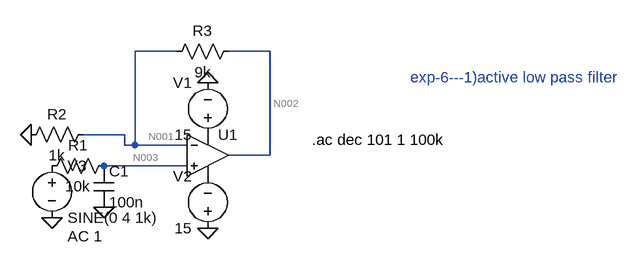
[diagram p0: schematic active low pass filter.asc]
active low pass filter.asc, the LTspice schematic file:
Version 4
SHEET 1 880 680
WIRE 128 16 64 16
WIRE 272 16 208 16
WIRE 48 144 -16 144
WIRE 48 160 48 144
WIRE 64 160 64 16
WIRE 64 160 48 160
WIRE 144 160 64 160
WIRE 272 176 272 16
WIRE 272 176 208 176
WIRE 144 192 16 192
FLAG 176 288 0
FLAG 176 64 0
FLAG -64 272 0
FLAG -96 144 0
FLAG 16 256 0
SYMBOL Opamps\\UniversalOpamp2 176 176 R0
SYMATTR InstName U1
SYMBOL voltage 176 160 R180
WINDOW 0 24 96 Left 2
WINDOW 3 24 16 Left 2
WINDOW 123 0 0 Left 0
WINDOW 39 0 0 Left 0
SYMATTR InstName V1
SYMATTR Value 15
SYMBOL voltage 176 304 R180
WINDOW 0 24 96 Left 2
WINDOW 3 24 16 Left 2
WINDOW 123 0 0 Left 0
WINDOW 39 0 0 Left 0
SYMATTR InstName V2
SYMATTR Value 15
SYMBOL res 32 176 R90
WINDOW 0 0 56 VBottom 2
WINDOW 3 32 56 VTop 2
SYMATTR InstName R1
SYMATTR Value 10k
SYMBOL cap 0 192 R0
SYMATTR InstName C1
SYMATTR Value 100n
SYMBOL voltage -64 176 R0
WINDOW 123 24 124 Left 2
WINDOW 39 0 0 Left 0
SYMATTR Value2 AC 1
SYMATTR InstName V3
SYMATTR Value SINE(0 4 1k)
SYMBOL res 0 128 R90
WINDOW 0 0 56 VBottom 2
WINDOW 3 32 56 VTop 2
SYMATTR InstName R2
SYMATTR Value 1k
SYMBOL res 224 0 R90
WINDOW 0 0 56 VBottom 2
WINDOW 3 32 56 VTop 2
SYMATTR InstName R3
SYMATTR Value 9k
TEXT 488 56 Left 2 ;exp-6---1)active low pass filter
TEXT 336 152 Left 2 !.ac dec 101 1 100k

The netlist it stands for:
* active low pass filter.asc
XU1 N003 N001 P001 P002 N002 level.2 Avol=1Meg GBW=10Meg Slew=10Meg ilimit=25m rail=0 Vos=0 phimargin=45 en=0 enk=0 in=0 ink=0 Rin=500Meg  ; pins IN+ IN- V+ V- OUT
V1 P001 0 15
V2 0 P002 15
R1 N003 P003 10k
C1 N003 0 100n
V3 P003 0 SINE(0 4 1k) AC 1
R2 N001 0 1k
R3 N002 N001 9k
* exp-6---1)active low pass filter
.ac dec 101 1 100k
.lib UniversalOpamps2.sub
.backanno
.end

* Results of the author's LTspice run, read from the files saved beside the schematic
* Operating Point, zero values left out:
*   V(p001) = 15 V
*   V(p002) = -15 V
*   I(V2) = -1.498 mA
*   I(V1) = -1.498 mA
*   Ix(u1:3) = 1.498 mA
*   Ix(u1:4) = -1.498 mA
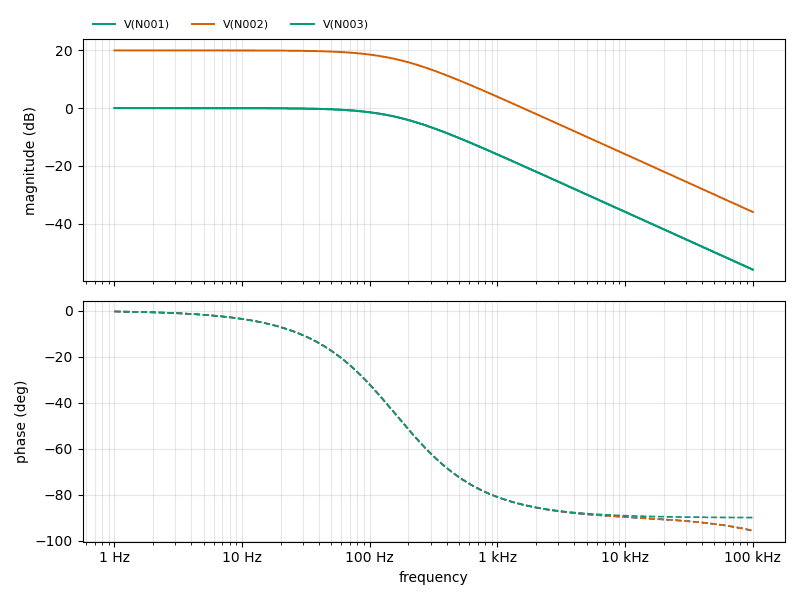
[diagram p1: AC Analysis of active low pass filter.asc, plotted from the saved traces]
* AC Analysis, 1 run:
*   V(N001): -0.00 dB at 1 Hz, -56.01 dB at 100 kHz, peak -0.00 dB at 1 Hz, 3 dB below the peak at 159.2 Hz
*   V(N002): 20.00 dB at 1 Hz, -36.01 dB at 100 kHz, peak 20.00 dB at 1 Hz, 3 dB below the peak at 159.2 Hz
*   V(N003): -0.00 dB at 1 Hz, -55.96 dB at 100 kHz, peak -0.00 dB at 1 Hz, 3 dB below the peak at 159.2 Hz